# Altium schematic sheet RMP_MACRO_MODULE.SchDoc
size Letter; SheetNumber: 5; SheetTotal: 7
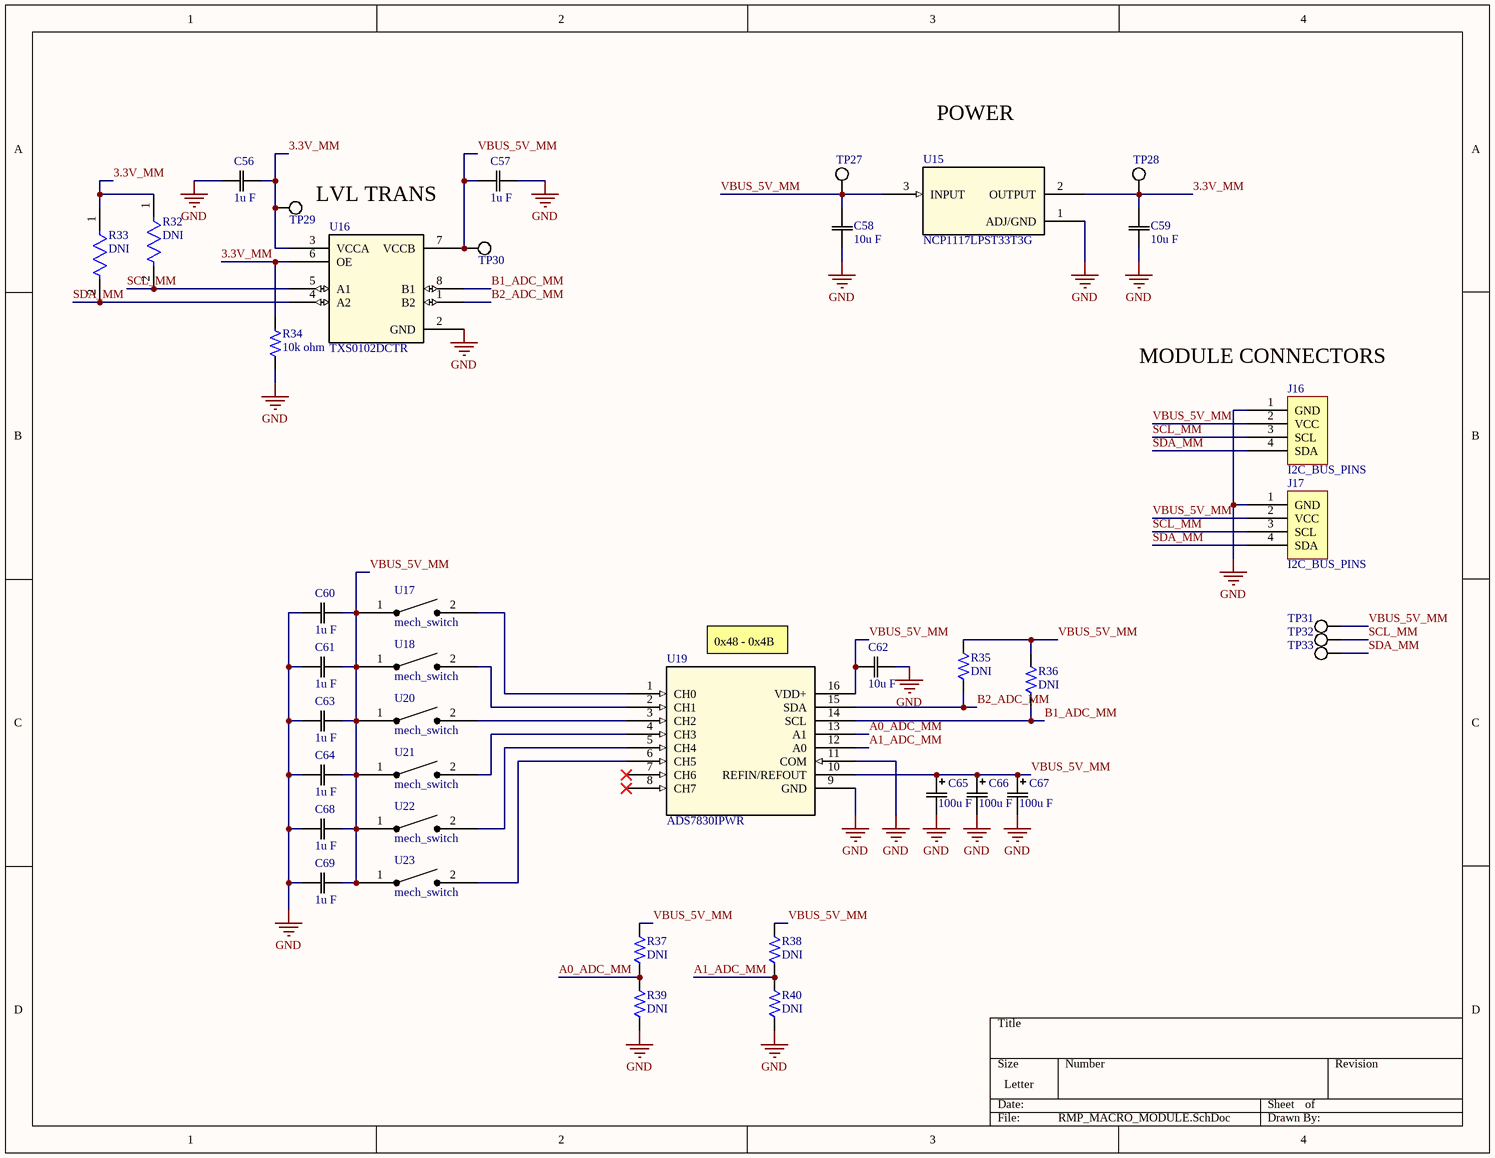
[diagram p0: RMP_MACRO_MODULE.SchDoc]

## Parts
C56  value 1u F  [CAP_CL21B105KAFNNNE_SAM-M]  (hidden comment: CL21B105KAFNNNE)
C57  value 1u F  [CAP_CL21B105KAFNNNE_SAM-M]  (hidden comment: CL21B105KAFNNNE)
C58  value 10u F  [G-21_MUR-M]  (hidden comment: GRM21BR61C106KE15K)
C59  value 10u F  [G-21_MUR-M]  (hidden comment: GRM21BR61C106KE15K)
C60  value 1u F  [CAP_CL21B105KAFNNNE_SAM-M]  (hidden comment: CL21B105KAFNNNE)
C61  value 1u F  [CAP_CL21B105KAFNNNE_SAM-M]  (hidden comment: CL21B105KAFNNNE)
C62  value 10u F  [G-21_MUR-M]  (hidden comment: GRM21BR61C106KE15K)
C63  value 1u F  [CAP_CL21B105KAFNNNE_SAM-M]  (hidden comment: CL21B105KAFNNNE)
C64  value 1u F  [CAP_CL21B105KAFNNNE_SAM-M]  (hidden comment: CL21B105KAFNNNE)
C65  value 100u F  [CAP_YX_6P3X11_RUB]  (hidden comment: 35YXJ100M6.3X11)
C66  value 100u F  [CAP_YX_6P3X11_RUB]  (hidden comment: 35YXJ100M6.3X11)
C67  value 100u F  [CAP_YX_6P3X11_RUB]  (hidden comment: 35YXJ100M6.3X11)
C68  value 1u F  [CAP_CL21B105KAFNNNE_SAM-M]  (hidden comment: CL21B105KAFNNNE)
C69  value 1u F  [CAP_CL21B105KAFNNNE_SAM-M]  (hidden comment: CL21B105KAFNNNE)
J16  I2C_BUS_PINS  [4 PIN HEADER]
J17  I2C_BUS_PINS  [4 PIN HEADER]
R32  Resistance: DNI  [FP-RT0805-MFG]  (hidden comment: RT0805FRE134K7L)
R33  Resistance: DNI  [FP-RT0805-MFG]  (hidden comment: RT0805FRE134K7L)
R34  value 10k ohm  [STA_RNCP0805_STP-M]  (hidden comment: RNCP0805FTD10K0)
R35  value DNI  [STA_RNCP0805_STP-M]  (hidden comment: RNCP0805FTD10K0)
R36  value DNI  [STA_RNCP0805_STP-M]  (hidden comment: RNCP0805FTD10K0)
R37  value DNI  [STA_RNCP0805_STP-M]  (hidden comment: RNCP0805FTD10K0)
R38  value DNI  [STA_RNCP0805_STP-M]  (hidden comment: RNCP0805FTD10K0)
R39  value DNI  [STA_RNCP0805_STP-M]  (hidden comment: RNCP0805FTD10K0)
R40  value DNI  [STA_RNCP0805_STP-M]  (hidden comment: RNCP0805FTD10K0)
TP27  TestPoint  [Testpoint]  (value not drawn)
TP28  TestPoint  [Testpoint]  (value not drawn)
TP29  TestPoint  [Testpoint]  (value not drawn)
TP30  TestPoint  [Testpoint]  (value not drawn)
TP31  TestPoint  [Testpoint]  (value not drawn)
TP32  TestPoint  [Testpoint]  (value not drawn)
TP33  TestPoint  [Testpoint]  (value not drawn)
U15  NCP1117LPST33T3G  [SOT223-3_ONS-M]
U16  TXS0102DCTR  [DCT8]
U17  mech_switch  [SW_MX1A-E1NW_CHY]
U18  mech_switch  [SW_MX1A-E1NW_CHY]
U19  ADS7830IPWR  [PW16-M]
U20  mech_switch  [SW_MX1A-E1NW_CHY]
U21  mech_switch  [SW_MX1A-E1NW_CHY]
U22  mech_switch  [SW_MX1A-E1NW_CHY]
U23  mech_switch  [SW_MX1A-E1NW_CHY]

## Nets
GND: C56.2 C57.1 C58.1 C59.1 C60.2 C61.2 C62.1 C63.2 C64.2 C65.2 C66.2 C67.2 C68.2 C69.2 J16.1(GND) J17.1(GND) R34.2 R39.1 R40.1 U15.1(ADJ/GND) U16.2(GND) U19.9(GND) U19.11(COM)
3.3V_MM: C56.1 C59.2 R32.1 R33.1 R34.1 TP28.1 TP29.1 U15.2(OUTPUT) U16.3(VCCA) U16.6(OE)
A0_ADC_MM: R37.1 R39.2 U19.13(A1)
A1_ADC_MM: R38.1 R40.2 U19.12(A0)
B1_ADC_MM: R36.1 U16.8(B1) U19.14(SCL)
B2_ADC_MM: R35.1 U16.1(B2) U19.15(SDA)
SCL_MM: J16.3(SCL) J17.3(SCL) R32.2 TP32.1 U16.5(A1)
SDA_MM: J16.4(SDA) J17.4(SDA) R33.2 TP33.1 U16.4(A2)
VBUS_5V_MM: C57.2 C58.2 C60.1 C61.1 C62.2 C63.1 C64.1 C65.1 C66.1 C67.1 C68.1 C69.1 J16.2(VCC) J17.2(VCC) R35.2 R36.2 R37.2 R38.2 TP27.1 TP30.1 TP31.1 U15.3(INPUT) U16.7(VCCB) U17.1 U18.1 U19.10(REFIN/REFOUT) U19.16(VDD+) U20.1 U21.1 U22.1 U23.1
NetU17_2: U17.2 U19.1(CH0)
NetU18_2: U18.2 U19.2(CH1)
NetU19_3: U19.3(CH2) U20.2
NetU19_4: U19.4(CH3) U21.2
NetU19_5: U19.5(CH4) U22.2
NetU19_6: U19.6(CH5) U23.2

Not connected (* = marked no-connect by the designer): U19 7(CH6)* 8(CH7)*

## Notes on the sheet
- POWER
- LVL TRANS
- (near J16) MODULE CONNECTORS
- (near U19) 0x48 - 0x4B

## Library data of the parts
C56 C57 C60 C61 C63 C64 C68 C69 = CAP_CL21B105KAFNNNE: 1 µF ±10% 25V Ceramic Capacitor X7R 0805 (2012 Metric); Mfr_Name: Samsung
C58 C59 C62 = CAP_GRM21BR61C106KE15K: 10 µF ±10% 16V Ceramic Capacitor X5R 0805 (2012 Metric); Mfr_Name: Murata
C65-C67 = CAP_35YXJ100M6.3X11: CAP ALUM 100UF 20% 35V RADIAL TH; Mfr_Name: Rubycon
R32 R33 = CMP-03412-025396-1: RT0805 4.7KΩ 0.125W 50 ppm/°C 0.01%; Manufacturer: Yageo; Tolerance: 0.0001; Voltage Rating: 150V; Category: Res; Footprint Url: http://www.yageo.com/exep/pages/download/literatures/PYu-R_Mount_10.pdf; Package: RT0805; Composition: Thin Film; Device Class L3: Chip SMD Resistors; Ipc Land Pattern Name: RESC200125X50; Temperature Range Low: -55°C; Lead Free: Yes; Temperature Range High: +155°C; Temperature Coefficient: 50 ppm/°C; Octopart: https://octopart.com/rt0805fre134k7l-yageo-16262042; ComponentLink2URL: http://www.yageo.com/documents/recent/PYu-RT_1-to-0.01_RoHS_L_9.pdf; Device Class L1: Passive Components; Value: 4.7KΩ; Automotive: No; Height: 0.6mm; Device Class L2: Resistors; RoHS: TRUE; Manufacturer Part Number: RT0805FRE134K7L; Power Rating: 0.125W; Temperature: -55°C to +155°C; Series: RT; ComponentLink2Description: Datasheet
R34-R40 = RES_RNCP0805FTD10K0: 10 kOhms ±1% 0.25W, 1/4W Chip Resistor 0805 (2012 Metric) Anti-Sulfur Thin Film; Supplier 1: Digikey; Supplier Part Number 1: RNCP0805FTD10K0CT-ND
U15 = NCP1117LPST33T3G: Linear Voltage Regulator IC Positive Fixed 1 Output 1A SOT-223; Mfr_Name: onsemi; RefDes: RefDes; Type: Type
U16 = TXS0102DCTR: Voltage Level Translator Bidirectional 1 Circuit 2 Channel 24Mbps SM8; Mfr_Name: Texas Instruments; RefDes: RefDes; Type: Type
U17 U18 U20-U23 = mech_switch: mechanical switch
U19 = ADS7830IPWR: 8 Bit Analog to Digital Converter 4, 8 Input 1 SAR 16-TSSOP; Mfr_Name: Texas Instruments; RefDes: RefDes; Type: Type